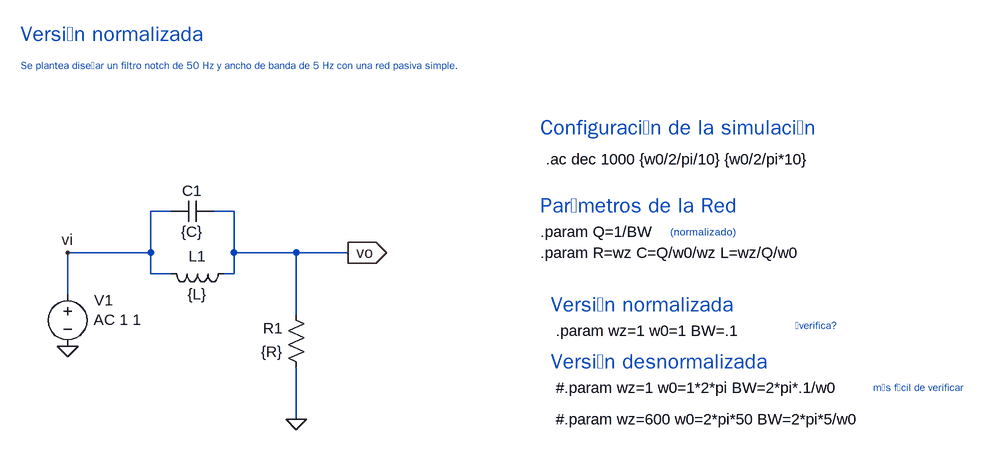
[diagram p0: schematic notch 50hz.asc]
notch 50hz.asc, the LTspice schematic file:
Version 4
SHEET 1 2616 808
WIRE -368 240 -400 240
WIRE -272 240 -304 240
WIRE -400 304 -400 240
WIRE -400 304 -528 304
WIRE -272 304 -272 240
WIRE -176 304 -272 304
WIRE -96 304 -176 304
WIRE -400 336 -400 304
WIRE -368 336 -400 336
WIRE -272 336 -272 304
WIRE -272 336 -288 336
WIRE -528 368 -528 304
WIRE -176 400 -176 304
WIRE -176 560 -176 480
FLAG -528 448 0
FLAG -528 304 vi
FLAG -96 304 vo
IOPIN -96 304 Out
FLAG -176 560 0
SYMBOL res -160 496 R180
WINDOW 0 36 76 Left 2
WINDOW 3 36 40 Left 2
SYMATTR InstName R1
SYMATTR Value {R}
SYMBOL cap -304 224 R90
WINDOW 0 0 32 VBottom 2
WINDOW 3 32 32 VTop 2
SYMATTR InstName C1
SYMATTR Value {C}
SYMBOL voltage -528 352 R0
WINDOW 123 40 55 Left 2
WINDOW 39 0 0 Left 0
WINDOW 0 41 25 Left 2
SYMATTR Value2 AC 1 1
SYMATTR InstName V1
SYMATTR Value ""
SYMBOL ind -272 320 R90
WINDOW 0 5 56 VBottom 2
WINDOW 3 32 56 VTop 2
SYMATTR InstName L1
SYMATTR Value {L}
TEXT 208 160 Left 2 !.ac dec 1000 {w0/2/pi/10} {w0/2/pi*10}
TEXT 224 560 Left 2 !#.param wz=600 w0=2*pi*50 BW=2*pi*5/w0
TEXT 216 384 Left 3 ;Versi�n normalizada
TEXT 216 472 Left 3 ;Versi�n desnormalizada
TEXT 224 424 Left 2 !.param wz=1 w0=1 BW=.1
TEXT 200 112 Left 3 ;Configuraci�n de la simulaci�n
TEXT 200 304 Left 2 !.param R=wz C=Q/w0/wz L=wz/Q/w0
TEXT 200 272 Left 2 !.param Q=1/BW
TEXT 200 232 Left 3 ;Par�metros de la Red
TEXT 224 512 Left 2 !#.param wz=1 w0=1*2*pi BW=2*pi*.1/w0
TEXT 400 272 Left 1 ;(normalizado)
TEXT 592 416 Left 1 ;�verifica?
TEXT 712 512 Left 1 ;m�s f�cil de verificar
TEXT -600 -32 Left 3 ;Versi�n normalizada
TEXT -600 16 Left 1 ;Se plantea dise�ar un filtro notch de 50 Hz y ancho de banda de 5 Hz con una red pasiva simple.

The netlist it stands for:
* notch 50hz.asc
R1 0 vo {R}
C1 vo vi {C}
V1 vi 0 AC 1 1
L1 vo vi {L}
.ac dec 1000 {w0/2/pi/10} {w0/2/pi*10}
#.param wz=600 w0=2*pi*50 BW=2*pi*5/w0
* Versi�n normalizada
* Versi�n desnormalizada
.param wz=1 w0=1 BW=.1
* Configuraci�n de la simulaci�n
.param R=wz C=Q/w0/wz L=wz/Q/w0
.param Q=1/BW
* Par�metros de la Red
#.param wz=1 w0=1*2*pi BW=2*pi*.1/w0
* (normalizado)
* �verifica?
* m�s f�cil de verificar
* Versi�n normalizada
* Se plantea dise�ar un filtro notch de 50 Hz y ancho de banda de 5 Hz con una red pasiva simple.
.backanno
.end